# Altium schematic sheet 01-LPDDR_FLASH.SchDoc: LPDDR, SPI Flash
size A3; DrawnBy: Rain Adelbert; Revision: 1.2; SheetNumber: 1; SheetTotal: 9; ProjectName: AsicVault PSD
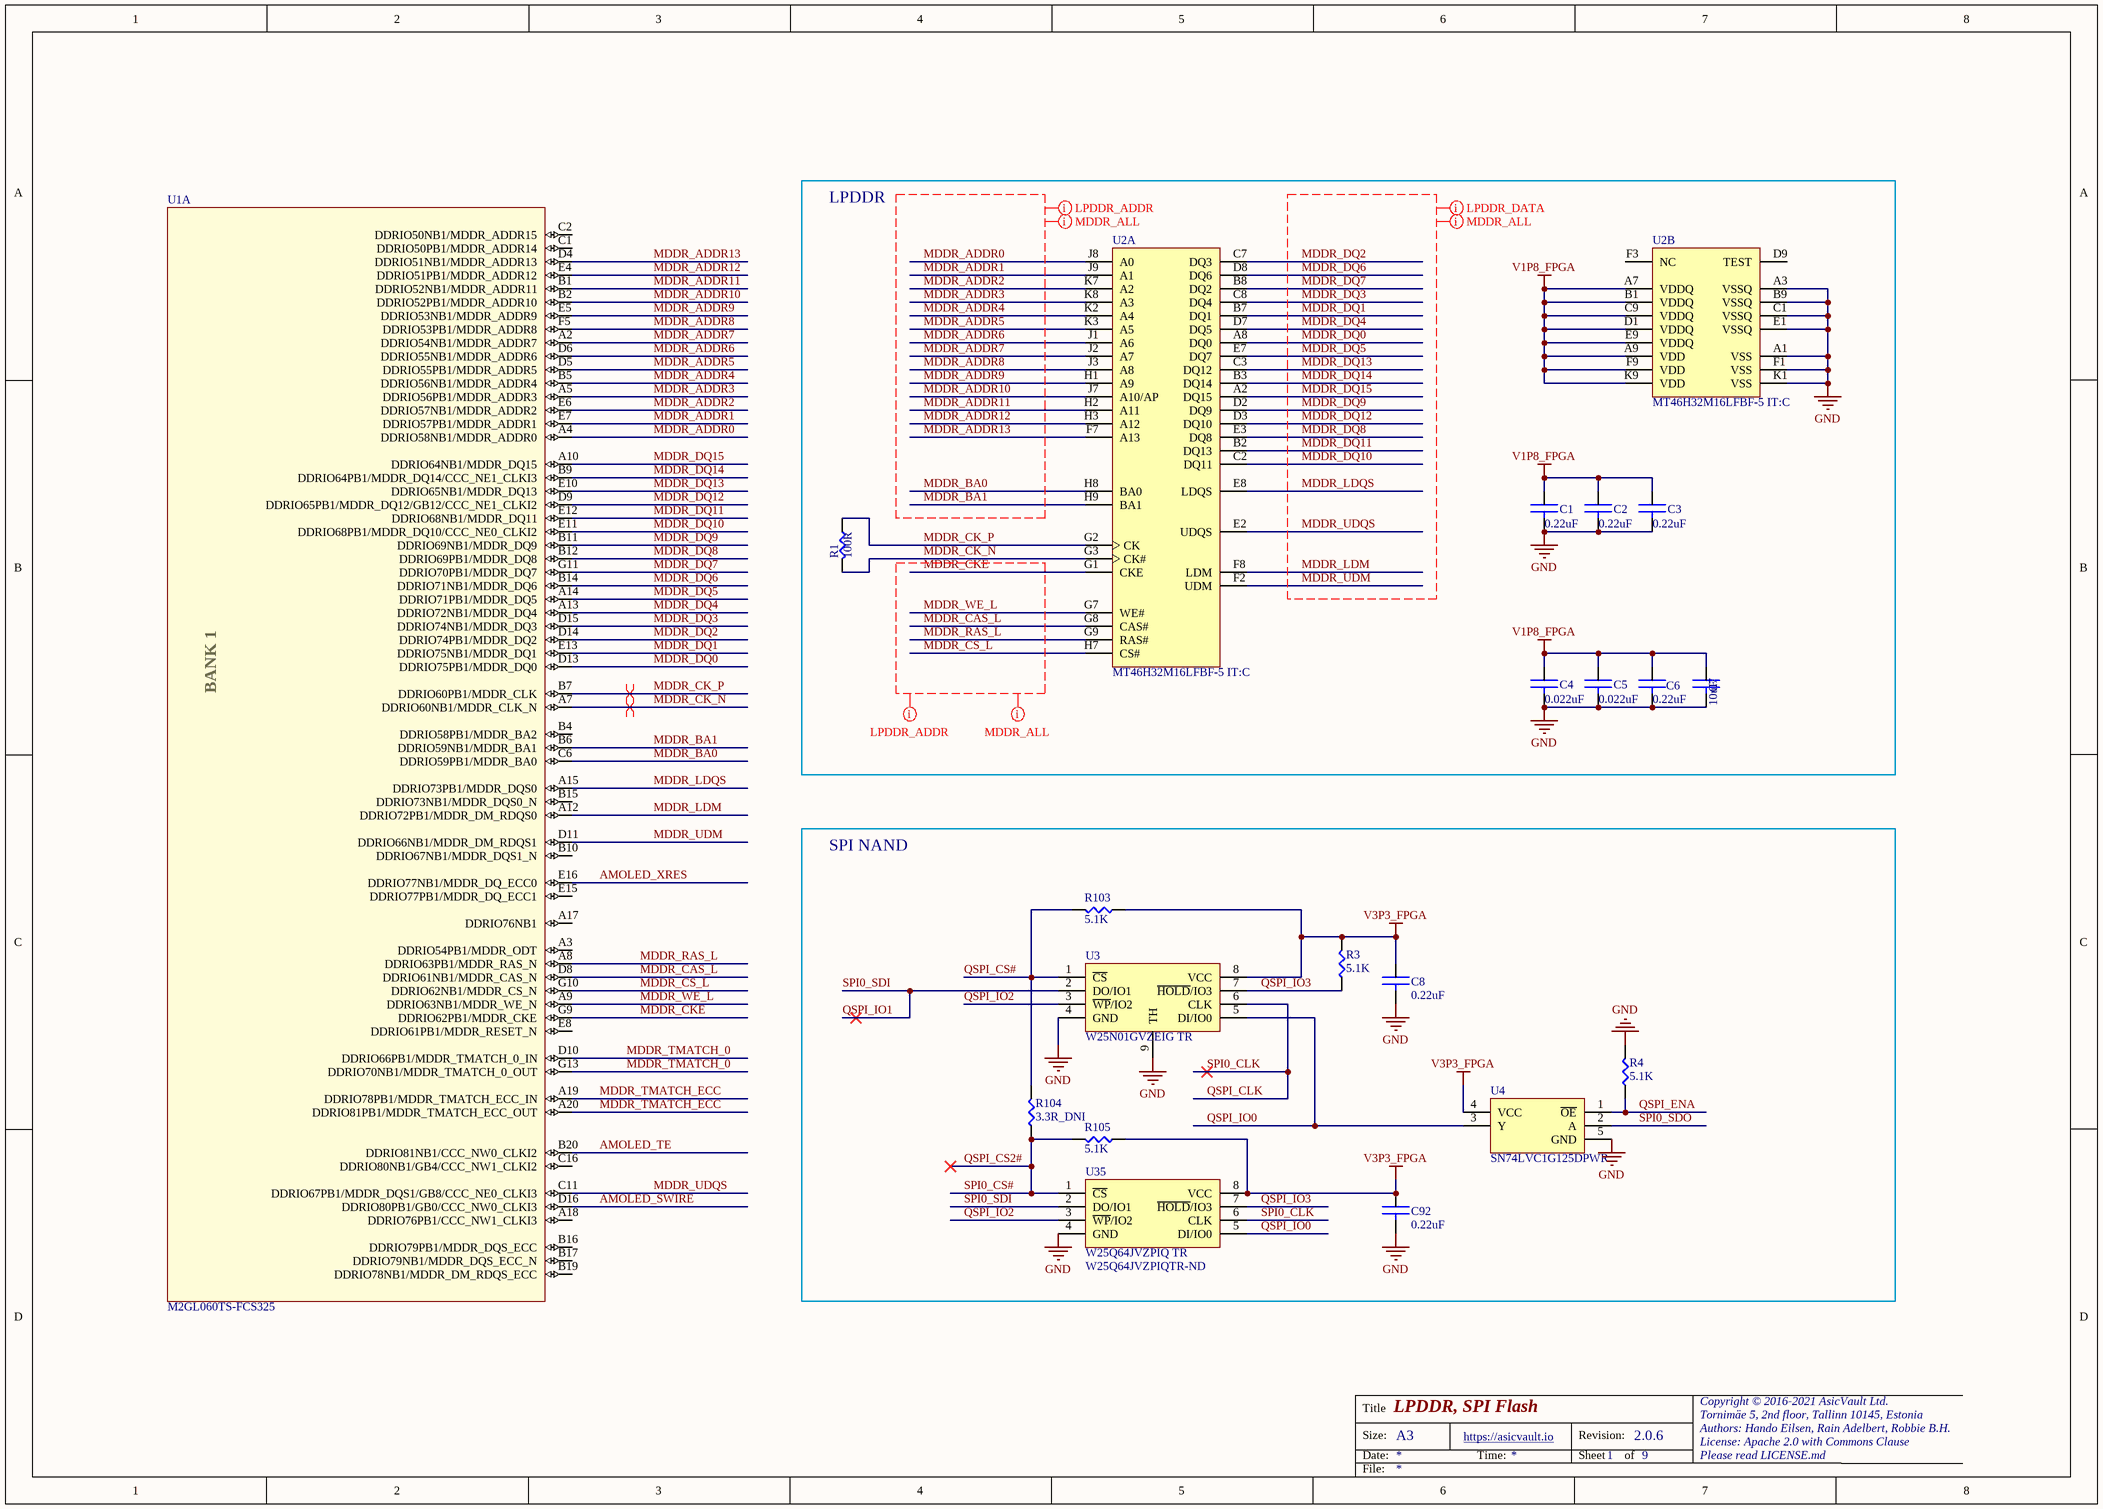
[diagram p0: 01-LPDDR_FLASH.SchDoc]

## Parts
C1  0.22uF  [C0201]
C2  0.22uF  [C0201]
C3  0.22uF  [C0201]
C4  0.022uF  [C0201]
C5  0.022uF  [C0201]
C6  0.22uF  [C0201]
C7  10uF  [C0402]
C8  0.22uF  [C0201]
C92  0.22uF  [C0201]
R1  100R  [R0201]
R3  5.1K  [R0201]
R4  5.1K  [R0201]
R103  5.1K  [R0201]
R104  3.3R_DNI  [R0201]
R105  5.1K  [R0201]
U1  M2GL060TS-FCS325  [FCS325-OPT1]  (part A of 16)
U2  MT46H32M16LFBF-5 IT:C  [MICT-BF-60]  (parts A,B of 2)
U3  W25N01GVZEIG TR  [WSON6X8]
U4  SN74LVC1G125DPWR  [X2SON4]
U35  W25Q64JVZPIQ TR  Supplier Part Number 1: W25Q64JVZPIQTR-ND  [WSON6X5]

## Blocks framed on the sheet
LPDDR: C1-C7 R1 U2
SPI NAND: C8 C92 R3 R4 R103-R105 U3 U4 U35

## Nets
GND: C1.2 C2.2 C3.2 C4.2 C5.2 C6.2 C7.2 C8.2 C92.2 R4.2 U2.A1(VSS) U2.A3(VSSQ) U2.B9(VSSQ) U2.C1(VSSQ) U2.E1(VSSQ) U2.F1(VSS) U2.K1(VSS) U3.4(GND) U3.9(TH) U4.5(GND) U35.4(GND)
V1P8_FPGA: C1.1 C2.1 C3.1 C4.1 C5.1 C6.1 C7.1 U2.A7(VDDQ) U2.A9(VDD) U2.B1(VDDQ) U2.C9(VDDQ) U2.D1(VDDQ) U2.E9(VDDQ) U2.F9(VDD) U2.K9(VDD)
V3P3_FPGA: C8.1 C92.1 R3.2 R103.1 R105.1 U3.8(VCC) U4.4(VCC) U35.8(VCC)
AMOLED_SWIRE: U1.D16(DDRIO80PB1/GB0/CCC_NW0_CLKI3)
AMOLED_TE: U1.B20(DDRIO81NB1/CCC_NW0_CLKI2)
AMOLED_XRES: U1.E16(DDRIO77NB1/MDDR_DQ_ECC0)
MDDR_ADDR0: U1.A4(DDRIO58NB1/MDDR_ADDR0) U2.J8(A0)
MDDR_ADDR1: U1.E7(DDRIO57PB1/MDDR_ADDR1) U2.J9(A1)
MDDR_ADDR2: U1.E6(DDRIO57NB1/MDDR_ADDR2) U2.K7(A2)
MDDR_ADDR3: U1.A5(DDRIO56PB1/MDDR_ADDR3) U2.K8(A3)
MDDR_ADDR4: U1.B5(DDRIO56NB1/MDDR_ADDR4) U2.K2(A4)
MDDR_ADDR5: U1.D5(DDRIO55PB1/MDDR_ADDR5) U2.K3(A5)
MDDR_ADDR6: U1.D6(DDRIO55NB1/MDDR_ADDR6) U2.J1(A6)
MDDR_ADDR7: U1.A2(DDRIO54NB1/MDDR_ADDR7) U2.J2(A7)
MDDR_ADDR8: U1.F5(DDRIO53PB1/MDDR_ADDR8) U2.J3(A8)
MDDR_ADDR9: U1.E5(DDRIO53NB1/MDDR_ADDR9) U2.H1(A9)
MDDR_ADDR10: U1.B2(DDRIO52PB1/MDDR_ADDR10) U2.J7(A10/AP)
MDDR_ADDR11: U1.B1(DDRIO52NB1/MDDR_ADDR11) U2.H2(A11)
MDDR_ADDR12: U1.E4(DDRIO51PB1/MDDR_ADDR12) U2.H3(A12)
MDDR_ADDR13: U1.D4(DDRIO51NB1/MDDR_ADDR13) U2.F7(A13)
MDDR_BA0: U1.C6(DDRIO59PB1/MDDR_BA0) U2.H8(BA0)
MDDR_BA1: U1.B6(DDRIO59NB1/MDDR_BA1) U2.H9(BA1)
MDDR_CAS_L: U1.D8(DDRIO61NB1/MDDR_CAS_N) U2.G8(CAS#)
MDDR_CK_N: R1.2 U1.A7(DDRIO60NB1/MDDR_CLK_N) U2.G3(CK#)
MDDR_CK_P: R1.1 U1.B7(DDRIO60PB1/MDDR_CLK) U2.G2(CK)
MDDR_CKE: U1.G9(DDRIO62PB1/MDDR_CKE) U2.G1(CKE)
MDDR_CS_L: U1.G10(DDRIO62NB1/MDDR_CS_N) U2.H7(CS#)
MDDR_DQ0: U1.D13(DDRIO75PB1/MDDR_DQ0) U2.A8(DQ0)
MDDR_DQ1: U1.E13(DDRIO75NB1/MDDR_DQ1) U2.B7(DQ1)
MDDR_DQ2: U1.D14(DDRIO74PB1/MDDR_DQ2) U2.C7(DQ3)
MDDR_DQ3: U1.D15(DDRIO74NB1/MDDR_DQ3) U2.C8(DQ4)
MDDR_DQ4: U1.A13(DDRIO72NB1/MDDR_DQ4) U2.D7(DQ5)
MDDR_DQ5: U1.A14(DDRIO71PB1/MDDR_DQ5) U2.E7(DQ7)
MDDR_DQ6: U1.B14(DDRIO71NB1/MDDR_DQ6) U2.D8(DQ6)
MDDR_DQ7: U1.G11(DDRIO70PB1/MDDR_DQ7) U2.B8(DQ2)
MDDR_DQ8: U1.B12(DDRIO69PB1/MDDR_DQ8) U2.E3(DQ8)
MDDR_DQ9: U1.B11(DDRIO69NB1/MDDR_DQ9) U2.D2(DQ9)
MDDR_DQ10: U1.E11(DDRIO68PB1/MDDR_DQ10/CCC_NE0_CLKI2) U2.C2(DQ11)
MDDR_DQ11: U1.E12(DDRIO68NB1/MDDR_DQ11) U2.B2(DQ13)
MDDR_DQ12: U1.D9(DDRIO65PB1/MDDR_DQ12/GB12/CCC_NE1_CLKI2) U2.D3(DQ10)
MDDR_DQ13: U1.E10(DDRIO65NB1/MDDR_DQ13) U2.C3(DQ12)
MDDR_DQ14: U1.B9(DDRIO64PB1/MDDR_DQ14/CCC_NE1_CLKI3) U2.B3(DQ14)
MDDR_DQ15: U1.A10(DDRIO64NB1/MDDR_DQ15) U2.A2(DQ15)
MDDR_LDM: U1.A12(DDRIO72PB1/MDDR_DM_RDQS0) U2.F8(LDM)
MDDR_LDQS: U1.A15(DDRIO73PB1/MDDR_DQS0) U2.E8(LDQS)
MDDR_RAS_L: U1.A8(DDRIO63PB1/MDDR_RAS_N) U2.G9(RAS#)
MDDR_TMATCH_0: U1.D10(DDRIO66PB1/MDDR_TMATCH_0_IN) U1.G13(DDRIO70NB1/MDDR_TMATCH_0_OUT)
MDDR_TMATCH_ECC: U1.A19(DDRIO78PB1/MDDR_TMATCH_ECC_IN) U1.A20(DDRIO81PB1/MDDR_TMATCH_ECC_OUT)
MDDR_UDM: U1.D11(DDRIO66NB1/MDDR_DM_RDQS1) U2.F2(UDM)
MDDR_UDQS: U1.C11(DDRIO67PB1/MDDR_DQS1/GB8/CCC_NE0_CLKI3) U2.E2(UDQS)
MDDR_WE_L: U1.A9(DDRIO63NB1/MDDR_WE_N) U2.G7(WE#)
QSPI_CLK: U3.6(CLK) U35.6(CLK)  [also labelled SPI0_CLK]
QSPI_CS2#: R104.1 R105.2 U35.1(~{CS})  [also labelled SPI0_CS#]
QSPI_CS#: R103.2 R104.2 U3.1(~{CS})
QSPI_ENA: R4.1 U4.1(~{OE})
QSPI_IO0: U3.5(DI/IO0) U4.3(Y) U35.5(DI/IO0)
QSPI_IO1: U3.2(DO/IO1) U35.2(DO/IO1)  [also labelled SPI0_SDI]
QSPI_IO2: U3.3(~{WP}/IO2) U35.3(~{WP}/IO2)
QSPI_IO3: R3.1 U3.7(~{HOLD}/IO3) U35.7(~{HOLD}/IO3)
SPI0_SDO: U4.2(A)

Not connected (* = marked no-connect by the designer): U1 A3(DDRIO54PB1/MDDR_ODT) A17(DDRIO76NB1) A18(DDRIO76PB1/CCC_NW1_CLKI3) B4(DDRIO58PB1/MDDR_BA2) B10(DDRIO67NB1/MDDR_DQS1_N) B15(DDRIO73NB1/MDDR_DQS0_N) B16(DDRIO79PB1/MDDR_DQS_ECC) B17(DDRIO79NB1/MDDR_DQS_ECC_N) B19(DDRIO78NB1/MDDR_DM_RDQS_ECC) C1(DDRIO50PB1/MDDR_ADDR14) C2(DDRIO50NB1/MDDR_ADDR15) C16(DDRIO80NB1/GB4/CCC_NW1_CLKI2) E8(DDRIO61PB1/MDDR_RESET_N) E15(DDRIO77PB1/MDDR_DQ_ECC1); U2 D9(TEST) F3(NC)

## Layout directives
differential pair: MDDR_CK_N, MDDR_CK_P
net class LPDDR_ADDR: MDDR_ADDR0, MDDR_ADDR1, MDDR_ADDR2, MDDR_ADDR3, MDDR_ADDR4, MDDR_ADDR5, MDDR_ADDR6, MDDR_ADDR7, MDDR_ADDR8, MDDR_ADDR9, MDDR_ADDR10, MDDR_ADDR11, MDDR_ADDR12, MDDR_ADDR13, MDDR_BA0, MDDR_BA1, MDDR_CAS_L, MDDR_CKE, MDDR_CS_L, MDDR_RAS_L, MDDR_WE_L
net class LPDDR_DATA: MDDR_DQ0, MDDR_DQ1, MDDR_DQ2, MDDR_DQ3, MDDR_DQ4, MDDR_DQ5, MDDR_DQ6, MDDR_DQ7, MDDR_DQ8, MDDR_DQ9, MDDR_DQ10, MDDR_DQ11, MDDR_DQ12, MDDR_DQ13, MDDR_DQ14, MDDR_DQ15, MDDR_LDM, MDDR_LDQS, MDDR_UDM, MDDR_UDQS
net class MDDR_ALL: MDDR_ADDR0, MDDR_ADDR1, MDDR_ADDR2, MDDR_ADDR3, MDDR_ADDR4, MDDR_ADDR5, MDDR_ADDR6, MDDR_ADDR7, MDDR_ADDR8, MDDR_ADDR9, MDDR_ADDR10, MDDR_ADDR11, MDDR_ADDR12, MDDR_ADDR13, MDDR_BA0, MDDR_BA1, MDDR_CAS_L, MDDR_CKE, MDDR_CS_L, MDDR_DQ0, MDDR_DQ1, MDDR_DQ2, MDDR_DQ3, MDDR_DQ4, MDDR_DQ5, MDDR_DQ6, MDDR_DQ7, MDDR_DQ8, MDDR_DQ9, MDDR_DQ10, MDDR_DQ11, MDDR_DQ12, MDDR_DQ13, MDDR_DQ14, MDDR_DQ15, MDDR_LDM, MDDR_LDQS, MDDR_RAS_L, MDDR_UDM, MDDR_UDQS, MDDR_WE_L

## Notes on the sheet
- Title
- Size:
- Date:
- A3
- https://asicvault.io
- Time:
- Revision:
- Sheet
- of
- 2.0.6
- Copyright © 2016-2021 AsicVault Ltd.
- Tornimäe 5, 2nd floor, Tallinn 10145, Estonia
- Authors: Hando Eilsen, Rain Adelbert, Robbie B.H.
- License: Apache 2.0 with Commons Clause
- Please read LICENSE.md
- File:
- (in symbol M2GL060TS-FCS325, part A) BANK 1

## Library data of the parts
C1-C3 C6 C8 C92 = 0.22uF/0201: Description 1: CAP CER 0.22UF 6.3V X7S 0201; Supplier 1: Digi-Key; Supplier Part Number 1: 445-9075-1-ND
C4 C5 = 0.022uF/0201: Description 1: CAP CER 0.022UF 10V X7S 0201; Supplier 1: Digi-Key; Supplier Part Number 1: 445-13740-1-ND
C7 = 10uF/0402: Description 1: Multilayer Ceramic Capacitors MLCC - SMD/SMT 10uF 20% 6.3 Volts 0402; Supplier 1: Mouser; Supplier Part Number 1: 791-0402X106M6R3CT
R1 = 100R/1%/0201: Description 1: RES SMD 100 OHM 1% 1/20W 0201; Supplier 1: Digi-Key; Supplier Part Number 1: 311-100MCT-ND
R3 R4 R103 R105 = 5.1K/1%/0201: Description 1: RES SMD 5.1K OHM 1% 1/20W 0201; Supplier 1: Digi-Key; Supplier Part Number 1: YAG2741CT-ND
R104 = 3.3R/1%/0201: Description 1: RES SMD 3.3 OHM 1% 1/20W 0201; Supplier 1: Digi-Key; Supplier Part Number 1: AC0201FR-073R3L-ND
U1 = M2GL060TS-FCS325: Description 1: IC FPGA 200 I/O 325FCBGA; Supplier 1: Digi-Key; Supplier Part Number 1: M2GL060TS-FCS325-ND
U2 = MT46H32M16LFBF-5 IT:C: Description 1: IC SDRAM 512MBIT 200MHZ 60BGA; Supplier 1: Digi-Key; Supplier Part Number 1: 557-1627-ND
U3 = W25N01GVZEIG TR: Description 1: IC FLASH 1GBIT 104MHZ 8WSON; Supplier 1: Digi-Key; Supplier Part Number 1: W25N01GVZEIGCT-ND
U4 = SN74LVC1G125DPWR: Description 1: IC BUS BUFF TRI-ST N-INV 4-X2SON; Supplier 1: Digi-Key; Supplier Part Number 1: 296-38461-1-ND
U35 = W25Q64JVZPIQ: Description 1: IC FLASH 64MBIT 104MHZ 8WSON; Supplier 1: Digi-Key